# EAGLE design mainBoard (EAGLE 9.0.1)

## Sheet 1 of 3
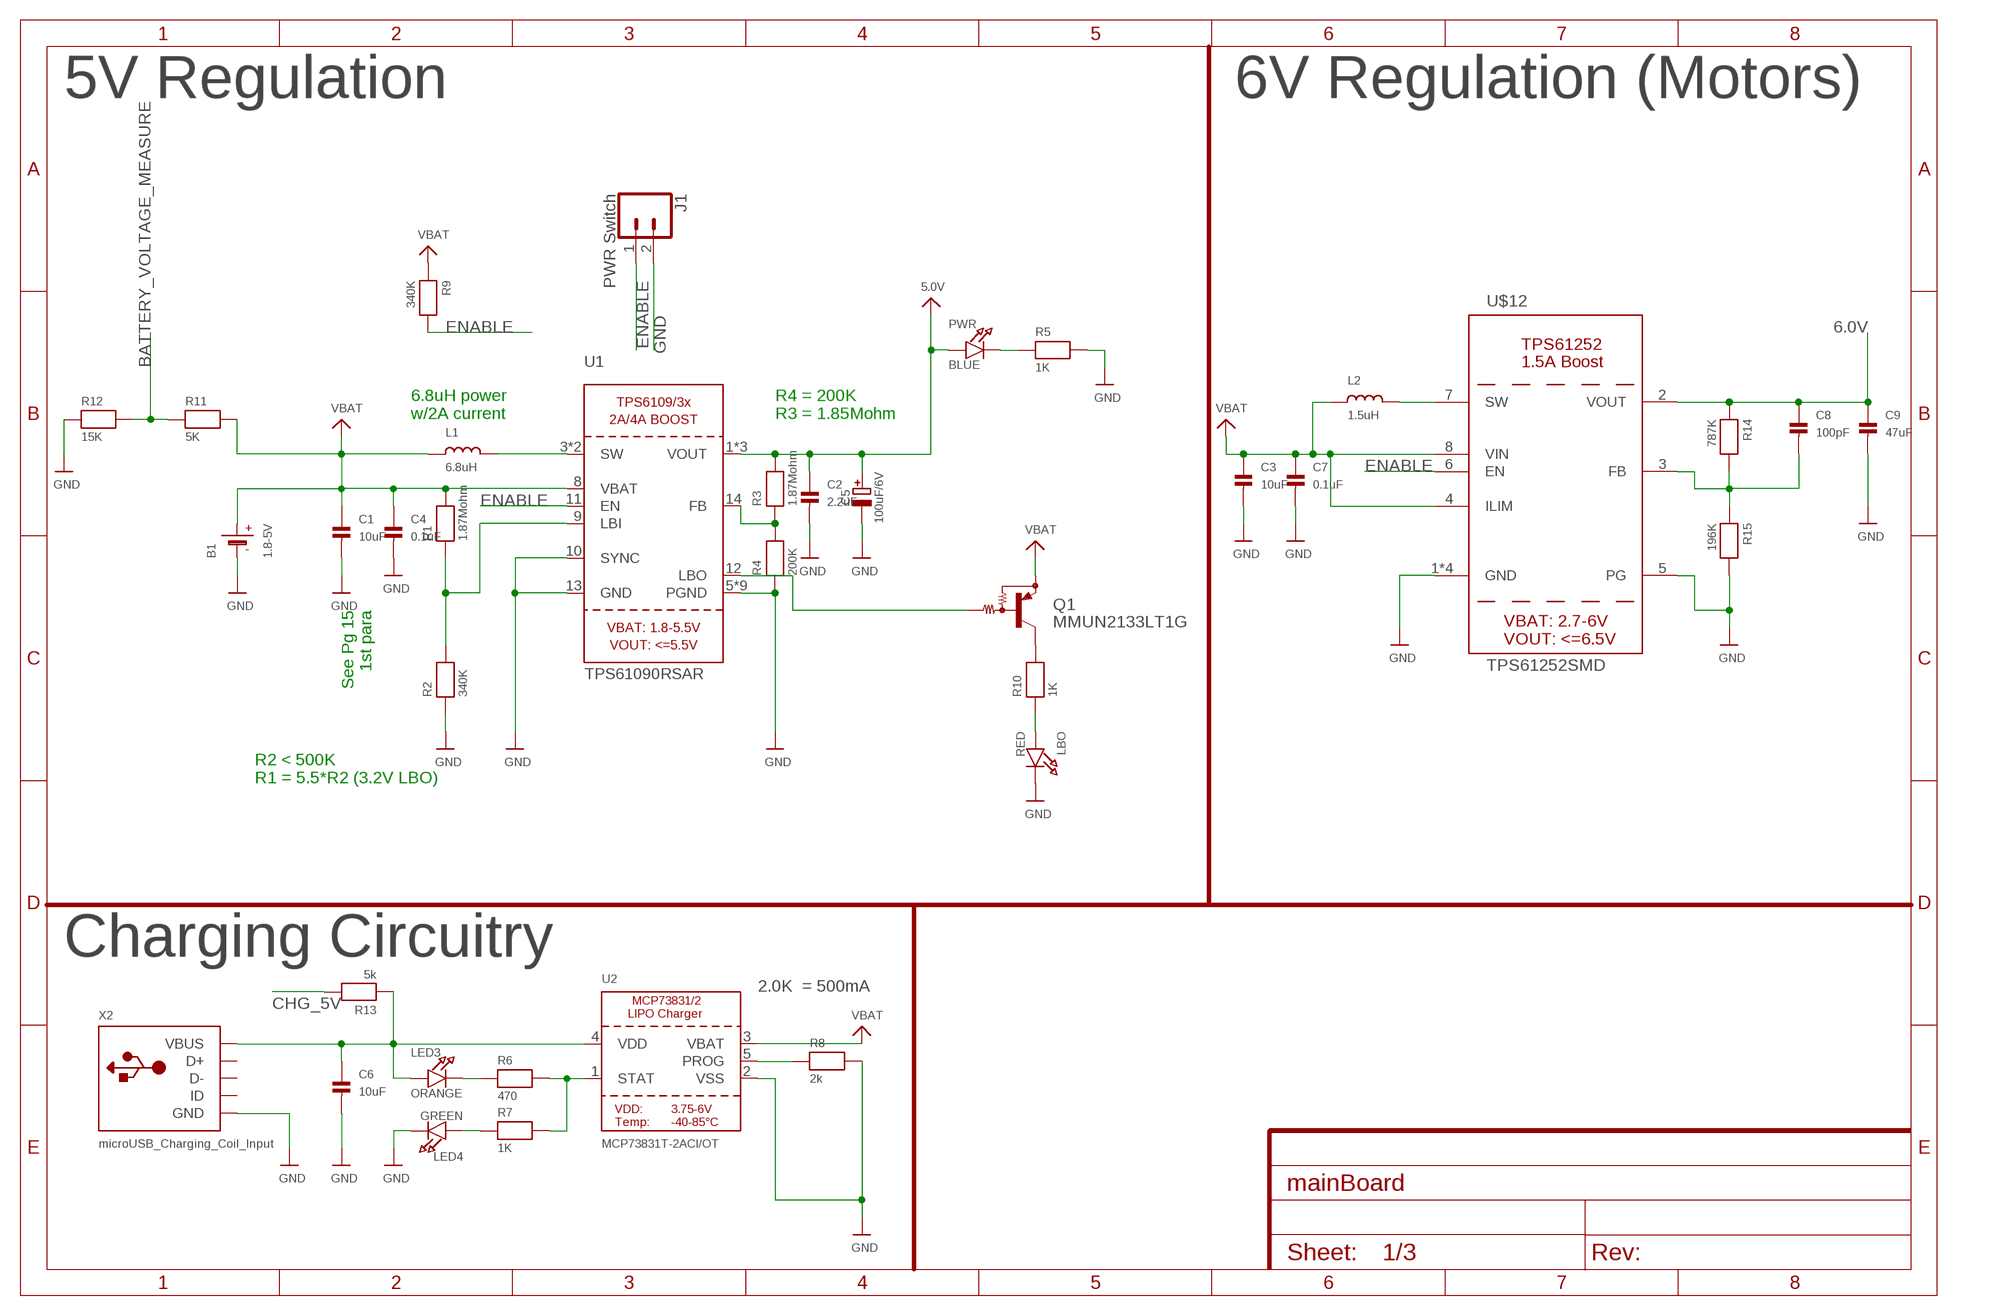
[diagram p0: schematic, sheet 1]
FRAME1 (FRAME-A4L): CNAME: Charging and Power Distribution; CREVISION: 1; DESIGNER: Sean Wilson

### Parts
B1  1.8-5V  BATTERY  [JSTPH2]
C1  10uF  CAP_CERAMIC0603  [0603]
C2  2.2uF  CAP_CERAMIC0603  [0603]
C3  10uF  CAP_CERAMIC0603  [0603]
C4  0.1uF  CAP_CERAMIC0805  [0805]
C5  100uF/6V  CAP_TANTALUMB/3528_REFLOW  [EIA3528-21/B-R]
C6  10uF  CAP_CERAMIC0603  [0603]
C7  0.1uF  CAP_CERAMIC0805  [0805]
C8  100pF  CAP_CERAMIC0603  [0603]
C9  47uF  CAP_CERAMIC1206  [1206]
J1  PWR Switch  CONN_02  [1X02]
L1  6.8uH  VISHAY_IHLP2525CZER6R8M01  [VISHAY_IHLP2525CZER6R8M01]
L2  1.5uH  MURATA_DFE252012P-1R5M=P2  [MURATA_DFE252012P-1R5M=P2]
LBO  RED  LED0805_NOOUTLINE  [CHIPLED_0805_NOOUTLINE]
LED3  ORANGE  LED0805_NOOUTLINE  [CHIPLED_0805_NOOUTLINE]
LED4  GREEN  LED0805_NOOUTLINE  [CHIPLED_0805_NOOUTLINE]
PWR  BLUE  LED0805_NOOUTLINE  [CHIPLED_0805_NOOUTLINE]
Q1  MMUN2133LT1G  MUN2114T1-PNP_DRIVER-SC59-BEC  [SC59-BEC]
R1  1.87Mohm  RESISTOR0805  [0805]
R2  340K  RESISTOR0805  [0805]
R3  1.87Mohm  RESISTOR0805  [0805]
R4  200K  RESISTOR0805  [0805]
R5  1K  RESISTOR0805  [0805]
R6  470  RESISTOR0805  [0805]
R7  1K  RESISTOR0805  [0805]
R8  2k  RESISTOR0805  [0805]
R9  340K  RESISTOR0805  [0805]
R10  1K  RESISTOR0805  [0805]
R11  5K  RESISTOR0805  [0805]
R12  15K  RESISTOR0805  [0805]
R13  5k  RESISTOR0805  [0805]
R14  787K  RESISTOR0805  [0805]
R15  196K  RESISTOR0805  [0805]
U1  TPS61090RSAR  VREG_TPS6103X  [PVQFN-16]
U2  MCP73831T-2ACI/OT  MCP73831/2  [SOT23-5]
U$12  TPS61252SMD  [TPS61252]
X2  microUSB_Charging_Coil_Input  USBMICRO_20329  [4UCONN_20329]

### Nets
5.0V: C2.1 C5.+ PWR.A R3.2 U1.1(VOUT) U1.15(VOUT) U1.16(VOUT) ; also sheet 2,3
6.0V: C8.1 C9.1 R14.1 U$12.2(VOUT) ; also sheet 3
BATTERY_VOLTAGE_MEASURE: R11.1 R12.2 ; also sheet 2
CHARGING_BOOL_5V: C6.1 LED3.A R13.1 U2.4(VDD) X2.VBUS
CHG_5V: R13.2 ; also sheet 2
ENABLE: J1.1 R9.2 U1.11(EN) U$12.6(EN)
GND: B1.1(-) C1.2 C2.2 C3.2 C4.2 C5.- C6.2 C7.2 C9.2 J1.2 LBO.C LED4.C R2.1 R4.1 R5.2 R8.2 R12.1 R15.2 U1.5(PGND) U1.6(PGND) U1.7(PGND) U1.10(SYNC) U1.13(GND) U1.P$18(PGND) U1.P$19(PGND) U1.P$20(PGND) U1.P$21(PGND) U1.P$22(PGND) U1.THERMAL(PGND) U2.2(VSS) U$12.1(GND) U$12.5(PG) U$12.P$2_GND(GND) U$12.P$3_GND(GND) U$12.THERMAL_GND(GND) X2.BASE@1(GND) X2.BASE@2(GND) X2.GND X2.SPRT@1(GND) X2.SPRT@2(GND) X2.SPRT@3(GND) X2.SPRT@4(GND) ; also sheet 2,3
LBO: Q1.B U1.12(LBO)
N$1: L1.P$2 U1.3(SW) U1.4(SW)
N$2: LBO.A R10.1
N$3: R1.1 R2.2 U1.9(LBI)
N$4: PWR.C R5.1
N$5: R3.1 R4.2 U1.14(FB)
N$6: LED3.C R6.1
N$7: R6.2 R7.2 U2.1(STAT)
N$8: R8.1 U2.5(PROG)
N$9: LED4.A R7.1
N$10: Q1.C R10.2
N$11: L2.P$2 U$12.7(SW)
N$12: C8.2 R14.2 R15.1 U$12.3(FB)
VBAT: B1.2(+) C1.1 C3.1 C4.1 C7.1 L1.P$1 L2.P$1 Q1.E R1.2 R9.1 R11.2 U1.8(VBAT) U2.3(VBAT) U$12.4(ILIM) U$12.8(VIN)
Unconnected: X2.D+ X2.D- X2.ID

### Notes on the sheet
- 5V Regulation | 6V Regulation (Motors)
- 6.8uH power
  w/2A current
- R4 = 200K
  R3 = 1.85Mohm
- See Pg 15
  1st para
- R2 < 500K
  R1 = 5.5*R2 (3.2V LBO)
- Charging Circuitry
- 2.0K  = 500mA

## Sheet 2 of 3
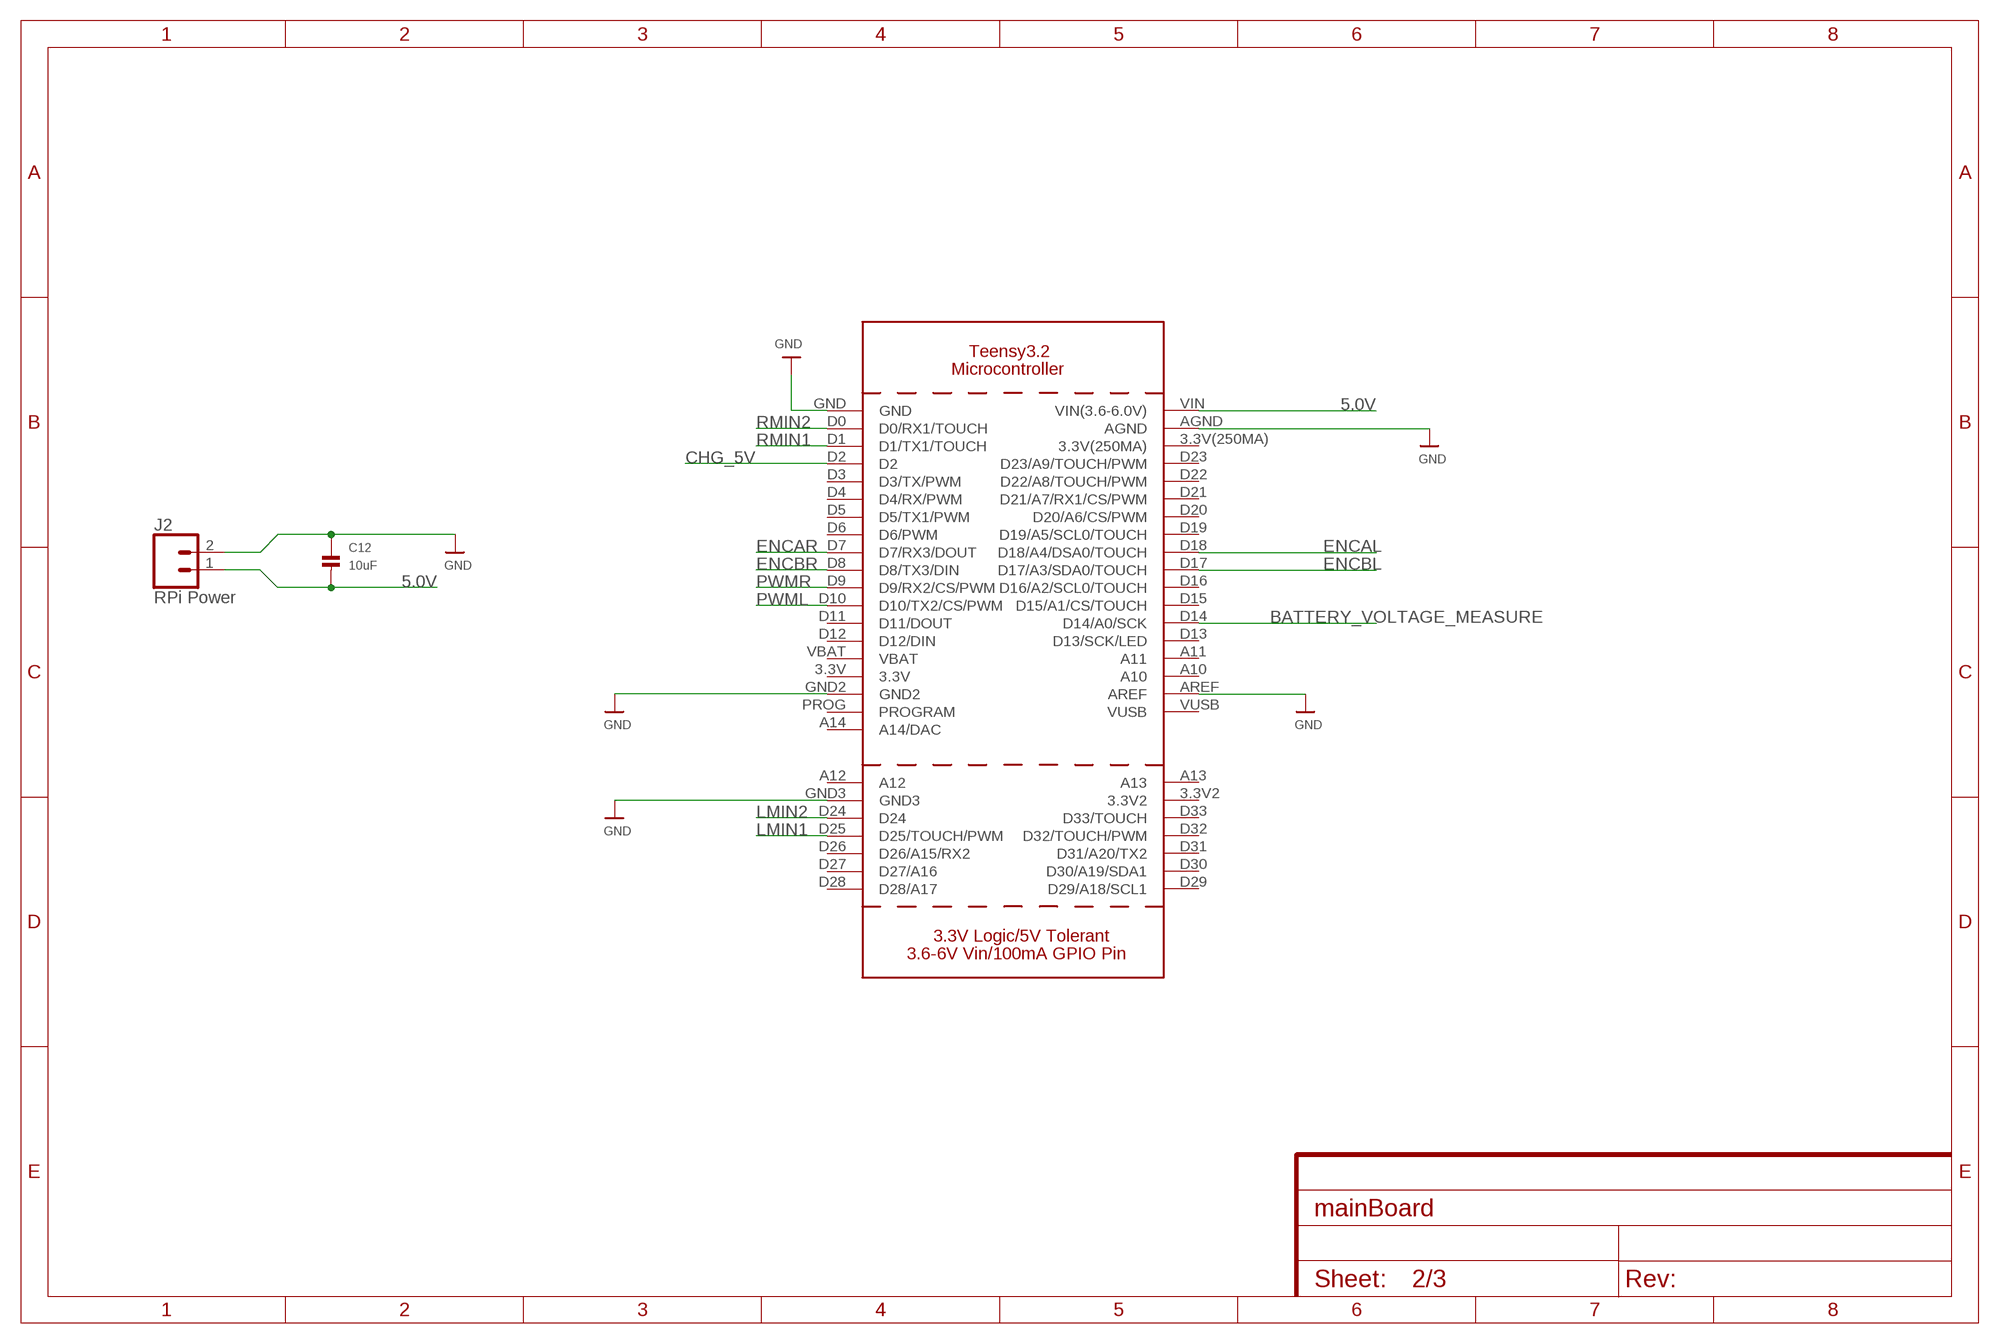
[diagram p1: schematic, sheet 2]
FRAME2 (FRAME-A4L): CNAME: Main Processor; CREVISION: 1; DESIGNER: Sean Wilson

### Parts
C12  10uF  CAP_CERAMIC0603  [0603]
J2  RPi Power  CONN_02  [1X02]
U$28  TEENSY3_2  [TEENSY3_2]

### Nets
5.0V: C12.2 J2.1 U$28.VIN(VIN(3.6-6.0V)) ; also sheet 1,3
BATTERY_VOLTAGE_MEASURE: U$28.D14(D14/A0/SCK) ; also sheet 1
CHG_5V: U$28.D2 ; also sheet 1
ENCAL: U$28.D18(D18/A4/DSA0/TOUCH) ; also sheet 3
ENCAR: U$28.D7(D7/RX3/DOUT) ; also sheet 3
ENCBL: U$28.D17(D17/A3/SDA0/TOUCH) ; also sheet 3
ENCBR: U$28.D8(D8/TX3/DIN) ; also sheet 3
GND: C12.1 J2.2 U$28.AGND U$28.AREF U$28.GND U$28.GND2 U$28.GND3 ; also sheet 1,3
LMIN1: U$28.D25(D25/TOUCH/PWM) ; also sheet 3
LMIN2: U$28.D24 ; also sheet 3
PWML: U$28.D10(D10/TX2/CS/PWM) ; also sheet 3
PWMR: U$28.D9(D9/RX2/CS/PWM) ; also sheet 3
RMIN1: U$28.D1(D1/TX1/TOUCH) ; also sheet 3
RMIN2: U$28.D0(D0/RX1/TOUCH) ; also sheet 3
Unconnected: U$28.3.3V U$28.3.3V2 U$28.3.3V(250MA) U$28.A10 U$28.A11 U$28.A12 U$28.A13 U$28.A14(A14/DAC) U$28.D3(D3/TX/PWM) U$28.D4(D4/RX/PWM) U$28.D5(D5/TX1/PWM) U$28.D6(D6/PWM) U$28.D11(D11/DOUT) U$28.D12(D12/DIN) U$28.D13(D13/SCK/LED) U$28.D15(D15/A1/CS/TOUCH) U$28.D16(D16/A2/SCL0/TOUCH) U$28.D19(D19/A5/SCL0/TOUCH) U$28.D20(D20/A6/CS/PWM) U$28.D21(D21/A7/RX1/CS/PWM) U$28.D22(D22/A8/TOUCH/PWM) U$28.D23(D23/A9/TOUCH/PWM) U$28.D26(D26/A15/RX2) U$28.D27(D27/A16) U$28.D28(D28/A17) U$28.D29(D29/A18/SCL1) U$28.D30(D30/A19/SDA1) U$28.D31(D31/A20/TX2) U$28.D32(D32/TOUCH/PWM) U$28.D33(D33/TOUCH) U$28.PROG(PROGRAM) U$28.VBAT U$28.VUSB

## Sheet 3 of 3
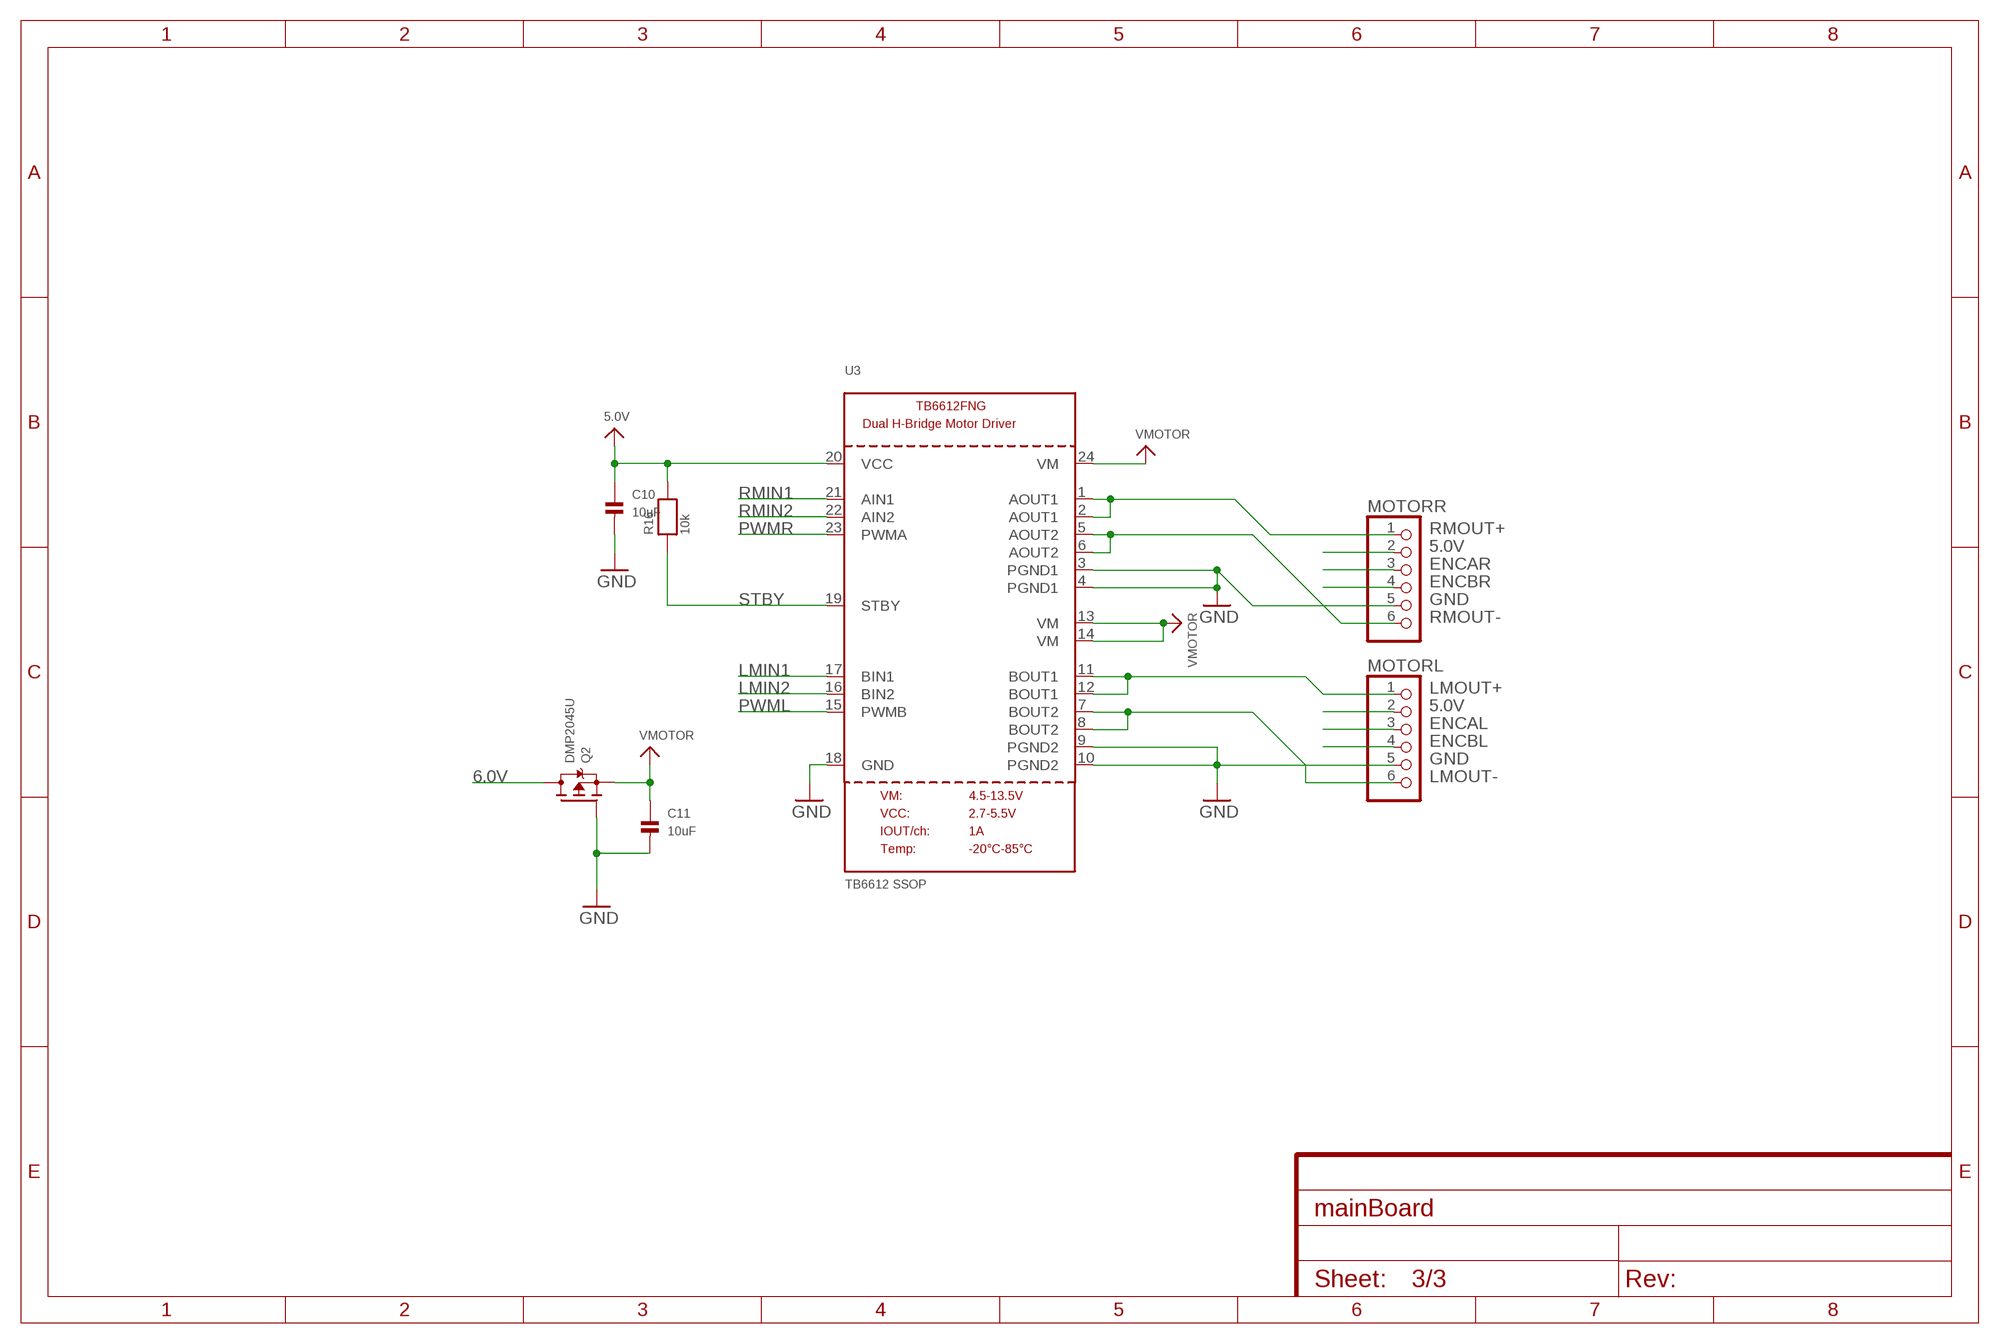
[diagram p2: schematic, sheet 3]
FRAME3 (FRAME-A4L): CNAME: Motor Driver; CREVISION: 1; DESIGNER: Sean Wilson

### Parts
C10  10uF  CAP_CERAMIC0603  [0603]
C11  10uF  CAP_CERAMIC0603  [0603]
MOTORL  PINHD-1X6CB  [1X06-CLEANBIG]
MOTORR  PINHD-1X6CB  [1X06-CLEANBIG]
Q2  DMP2045U  MOSFET-PWIDE  [SOT23-WIDE]
R16  10k  RESISTOR0805  [0805]
U3  TB6612 SSOP  TB6612FNGSSOP  [SSOP24]

### Nets
5.0V: C10.1 MOTORL.2 MOTORR.2 R16.2 U3.20(VCC) ; also sheet 1,2
6.0V: Q2.3(D) ; also sheet 1
ENCAL: MOTORL.3 ; also sheet 2
ENCAR: MOTORR.3 ; also sheet 2
ENCBL: MOTORL.4 ; also sheet 2
ENCBR: MOTORR.4 ; also sheet 2
GND: C10.2 C11.2 MOTORL.5 MOTORR.5 Q2.1(G) U3.3(PGND1) U3.4(PGND1) U3.9(PGND2) U3.10(PGND2) U3.18(GND) ; also sheet 1,2
LMIN1: U3.17(BIN1) ; also sheet 2
LMIN2: U3.16(BIN2) ; also sheet 2
LMOUT+: MOTORL.1 U3.11(BOUT1) U3.12(BOUT1)
LMOUT-: MOTORL.6 U3.7(BOUT2) U3.8(BOUT2)
PWML: U3.15(PWMB) ; also sheet 2
PWMR: U3.23(PWMA) ; also sheet 2
RMIN1: U3.21(AIN1) ; also sheet 2
RMIN2: U3.22(AIN2) ; also sheet 2
RMOUT+: MOTORR.1 U3.1(AOUT1) U3.2(AOUT1)
RMOUT-: MOTORR.6 U3.5(AOUT2) U3.6(AOUT2)
STBY: R16.1 U3.19(STBY)
VMOTOR: C11.1 Q2.2(S) U3.13(VM) U3.14(VM) U3.24(VM)

## Library data of the parts
B1 = microbuilder:BATTERY: CR1220 SMT - Digikey: 3001K-ND CD2032 BAT-HLD-001 - Digikey: BAT-HLD-001-ND
C1-C4 C6-C12 = microbuilder:CAP_CERAMIC: Ceramic Capacitors 0402 - 0402 Surface Mount Capacitors 16pF 50V 5% [Digikey: 445-4899-2-ND] 18pF 50V 5% [Digikey: 490-1281-2-ND] 22pF 50V 5% [Digikey: 490-1283-2-ND] 68pF 50V 5% [Digikey: 490-1289-2-ND] 0.1uF 10V 10% [Digikey: 490-1318-2-ND] 1.0uF 6.3V 10% [Digikey: 490-1320-2-ND] 0603 - 0603 Surface Mount Capacitors 16 pF 50V 5% [Digikey: 445-5051-2-ND] 22 pF 50V [Digikey: PCC220ACVTR-ND] 33 pF 50V 5% [Digikey: 490-1415-1-ND] 56pF 50V 5% [Digikey: 490-1421-1-ND] 220pF 50V 5% [Digikey: 445-1285-1-ND] 680 pF 50V 2200 pF 50V 5% C0G [Digikey: 445-1297-1-ND] 5600 pF 100V 5% X7R [Digikey: 478-3711-1-ND] 0.1 µF 25V 10% [Digikey: PCC2277TR-ND] 0.22 µF 16V 10% X7R [Digikey: 445-1318-1-ND] 1.0 µF 25V 10% [Digikey: 445-5146-2-ND] 0603 - RF Specific 3pF 250V +/-0.1pF RF [Digikey: 712-1347-1-ND] 18 pF 250V 5% [Digikey: 478-3505-1-ND or 712-1322-1-ND] 56 pF 250V 5% C0G RF [Digikey: 490-4867-1-ND] 68 pF 250V RF [Digikey: 490-4868-1-ND] 0805 - 0805 Surface Mount Capacitors 220 pF 250V 2% RF Ceramic Capacitor [Digikey: 712-1398-1-ND] 1000 pF 50V 2% NP0 Ceramic Capacitor [Digikey: 478-3760-1-ND] 0.1 µF 25V 10% Ceramic Capacitor [Digikey: PCC1828TR-ND] 1.0 µF 16V 10% Ceramic Capacitor[Digikey: 490-1691-2-ND] 10.0 µF 10V 10% Ceramic Capacitor[Digikey: 709-1228-1-ND] 10.0 uF 16V 10% Ceramic Capacitor [Digikey: 478-5165-2-ND] 47 uF 6.3V 20% Ceramic Capacitor [Digikey: 587-1779-1-ND or 399-5506-1-ND] 1206 - 1206 Surface Mount Capacitors 47uF 10V 20% Ceramic Capacitor [Digikey: 490-5528-1-ND or 399-5508-1-ND or 445-6010-1-ND] 100uF 6.3V -20%, +80% Y5V Ceramic Capacitor (Digikey: 490-4512-1-ND, Mouser: 81-GRM31CF50J107ZE1L)
C5 = microbuilder:CAP_TANTALUM: Tantalum Capacitors Wave footprints have larger pads and are meant to be used for hand soldering. Reflow footprints are optimised for solder paste and a reflow oven. EIA3216-18/A-[R/W] - Size A / 3216-18 / 1206 footprint 4.7µF 25V 10% Tantalum Capacitor 10µF 16V 10% Tantalum Capacitor [Digikey: 495-2236-2-ND] EIA3528-21/B-[R/W] - Size B / 3528-21 47µF 10V 10% Tantalum Capactior [Digikey: 495-2216-1-ND] EIA6032-28/C-[R/W] - Size C / 6032-28 10µF 35V 20% Tantalum Capacitor [Digikey: 495-2285-1-ND] 100µF 16V 10% Tantalum Capactior [Digikey: 399-5214-1-ND]
J1 J2 = SparkFun-Connectors:CONN_02: Multi connection point. Often used as Generic Header-pin footprint for 0.1 inch spaced/style header connections On any of the 0.1 inch spaced packages, you can populate with these: Break Away Headers - Straight <https://www.sparkfun.com/products/116> (PRT-00116) Break Away Male Headers - Right Angle <https://www.sparkfun.com/products/553> (PRT-00553) Female Headers <https://www.sparkfun.com/products/115> (PRT-00115) Break Away Headers - Machine Pin <https://www.sparkfun.com/products/117> (PRT-00117) Break Away Female Headers - Swiss Machine Pin <https://www.sparkfun.com/products/743> (PRT-00743) For SCREWTERMINALS and SPRING TERMINALS visit here: Screw Terimnals on SparkFun.com <https://www.sparkfun.com/search/results?term=Screw+Terminals> (5mm/3.5mm/2.54mm spacing) This device is also useful as a general connection point to wire up your design to another part of your project. Our various solder wires solder well into these plated through hole pads. Hook-Up Wire - Assortment (Stranded, 22 AWG) <https://www.sparkfun.com/products/11375> (PRT-11375) Hook-Up Wire - Assortment (Solid Core, 22 AWG) <https://www.sparkfun.com/products/11367> (PRT-11367) View the entire wire category on our website here <https://www.sparkfun.com/categories/141> Special notes: Molex polarized connector foot print use with: PRT-08233 with associated crimp pins and housings. 2.54_SCREWTERM for use with PRT-10571. 3.5mm Screw Terminal footprints for PRT-08084 5mm Screw Terminal footprints for use with PRT-08432
L1 = gritsbotx_electronics:VISHAY_IHLP2525CZER6R8M01
L2 = gritsbotx_electronics:MURATA_DFE252012P-1R5M=P2
LBO LED3 LED4 PWR = microbuilder:LED: LED 0603 - 0603 Surface Mount Package 2mA: Green LED - Low Power (3.9mcd, 2ma, 1.7Vf) - Digikey: 475-2709-2-ND Orange LED - Low Power (9.8mcd, 2ma, 1.8Vf) - Digikey: 475-1194-2-ND Red LED - Low Power (5mcd, 2ma, 1.8Vf) - Digikey: 475-1195-2-ND Yellow LED - Low Power (7mcd, 2ma, 1.8Vf) - Digikey: 475-1196-2-ND 5mA: Blue LED - Low Power (17mcd, 5ma, 2.9Vf) - Digikey: LNJ937W8CRACT-ND 0805 - 0805 Surface Mount Package 2mA: Red LED (8.8mcd, 2mA, 1.8Vf, Clear) - Low Power [Digikey: 475-2510-1-ND] Green LED (5mcd, 2mA, 1.8Vf, Clear) - Low Power [Digikey: 475-2730-1-ND] Yellow LED (11.3mcd, 2mA, 1.8Vf, Clear) - Low Power [Digikey: 475-2555-1-ND] 20mA: Red LED (104mcd, 20mA, Diffused) - LS R976 [Digikey: 475-1278-6-ND] Red LED (12mcd, 20mA, 2.0Vf, Clear) - APT2012EC [Digikey: 754-1128-1-ND] Green LED (15mcd, 20mA, 2.2Vf, Clear) - APT2012GC [Digikey: 754-1131-1-ND] Orange LED (160mcd, 20mA, 2.1Vf, Clear) - APT2012SECK [Digikey: 754-1130-1-ND] 1206 - 1206 Surface Mount Package Green LED (26mcd, 20mA, Diffused) - LG N971 [Digikey: 475-1407-6-ND] Red LED (15mcd, 20mA, Diffused) - LH N974 [Digikey: 475-1416-6-ND] Cree - Cree High-Power Surface Mount LEDs XPEBWT-L1-0000-00D50 - White 111lm 350mA 2.9Vf 6200K 110° XTEAWT-00-0000-00000LEE3 - White 114lm 350mA 2.85Vf 5000K 115° Everlight - Everlight 45-21 Series Surface Mount LEDs 45-21/QK2C-B2832AC2CB2/2T - Warm White 2000mcd 20mA 3.25Vf 3050K 120° 45-21/LK2C-B38452C4CB2/2T - Nuetral White 2000mcd 20mA 3.25Vf 4150K 120° 45-21/LK2C-B50634C6CB2/2T - Cold White 2200mcd 20mA 3.25Vf 5650K 120° PLCC2 Reverse Mount LS T77K-J1L2-1-0-2-R18-Z - Red 11.25mcd 2mA 1.8Vf 630nm 120° LO T77K-L1M2-24-Z - Orange 19.6mcd 2mA 1.8Vf 606nm 120° LY T77K-K2M1-26-Z - Yellow 15.7mcd 2mA 1.8Vf 587nm 120°
MOTORL MOTORR = adafruit:PINHD-1X6: PIN HEADER
Q1 = transistor:*-PNP_DRIVER-: PNP Bias Resistor Transistor
Q2 = microbuilder:MOSFET-P: P-Channel Mosfet LEGEND VDS: Voltage Drain-Source ID: Drain Current RDS(ON): Drain-Source On-State Resistance VGS(TH): Gate-Source Threshold Voltage CISS: Drain-Source Input Capacitance SOT-23 Name VDS ID RDS(ON) VGS(TH) CISS Order Number IRLML5103 30V 760mA 600 mOhm -- 75pF @ 25V Digikey: IRLML5103PBFCT-ND IRLML6401 12V 4.3A 50 mOhm 950mV @ 250µA 830pF @ 10V Digikey: IRLML6401PBFTR-ND NTR0202PL 20V 400mA 800 mOhm 2.3V @ 250uA 70pF @ 5V Digikey: NTR0202PLT1GOSTR-ND NTR4101PT1G 20V 1.8A 85 mOhm 1.2V @ 250uA 675pF @ 10V Digikey: NTR4101PT1GOSCT-ND DMP2004K 20V 600mA 900 mOhm 1V @ 250uA 175pF @ 16V Digikey: DMP2004KDICT-ND PMV65XP 20V 3.9A 76 mOhm 950mV @ 1mA 725pF @ 20V Digikey: 568-2358-2-ND TO-252 Name VDS ID RDS(ON) VGS(TH) CISS Order Number AOD417 30V 25A 34 mOhm 3V @ 250µA 920pF @ 15V Digikey: 785-1106-2-ND
R1-R16 = microbuilder:RESISTOR: Resistors 0402 - 0402 Surface Mount Package 22 Ohm 1% 1/16W [Digikey: 311-22.0LRTR-ND] 33 Ohm 5% 1/16W 1.0K 5% 1/16W 1.5K 5% 1/16W 2.0K 1% 1/16W 10.0K 1% 1/16W [Digikey: 311-10.0KLRTR-ND] 10.0K 5% 1/16W [Digikey: RMCF0402JT10K0TR-ND] 12.1K 1% 1/16W [Digikey: 311-22.0LRTR-ND] 100.0K 5% 1/16W 0603 - 0603 Surface Mount Package 0 Ohm 1/10 Watt 1% Resistor 15 Ohm 1/10 Watt 1% Resistor 33 Ohm 1/10 Watt 1% Resistor 49.9 Ohm 1/10 Watt 1% Resistor 100 Ohm 1/10 Watt 1% Resistor 150 Ohm 1/10 Watt 1% Resistor 240 Ohm 1/10 Watt 1% Resistor 390 Ohm 1/10 Watt 1% Resistor 560 Ohm 1/10 Watt 1% Resistor 680 Ohm 1/10 Watt 1% Resistor 750 Ohm 1/10 Watt 1% Resistor 1.0K Ohm 1/10 Watt 1% Resistor 1.5K Ohm 1/10 Watt 1% Resistor 2.0K Ohm 1/10 Watt 1% Resistor 2.2K Ohm 1/10 Watt 1% Resistor 3.3K Ohm 1/10 Watt 1% Resistor 4.7K Ohm 1/10 Watt 1% Resistor 10.0K Ohm 1/10 Watt 1% Resistor 12.0K Ohm 1/10 Watt 1% Resistor 12.1K Ohm 1/10 Watt 1% Resistor 20.0K Ohm 1/10 Watt 1% Resistor 33.0K Ohm 1/10 Watt 1% Resistor 100.0K Ohm 1/10 Watt 1% Resistor 0805 - 0805 Surface Mount Package 0 Ohm 1/8 Watt 1% Resistor 33 Ohm 1/8 Watt 1% Resistor 100 Ohm 1/8 Watt 1% Resistor 150 Ohm 1/8 Watt 1% Resistor 200 Ohm 1/8 Watt 1% Resistor 240 Ohm 1/8 Watt 1% Resistor 330 Ohm 1/8 Watt 1% Resistor 390 Ohm 1/8 Watt 1% Resistor 470 Ohm 1/8 Watt 1% Resistor 1.0K Ohm 1/8 Watt 1% Resistor 1.5K Ohm 1/8 Watt 1% Resistor 2.0K Ohm 1/8 Watt 1% Resistor 4.7K Ohm 1/8 Watt 1% Resistor 5.1K Ohm 1/8 Watt 1% Resistor 5.6K Ohm 1/8 Watt 1% Resistor 10.0K Ohm 1/8 Watt 1% Resistor 22.0K Ohm 1/8 Watt 1% Resistor 33.0K Ohm 1/8 Watt 1% Resistor 100K Ohm 1/8 Watt 1% Resistor 1206 - 1206 Surface Mount Package 2012 - 2010 Surface Mount Package 0.11 Ohm 1/2 Watt 1% Resistor - Digikey: RHM.11UCT-ND
U1 = microbuilder:VREG_TPS6103X: TPS6103x 4A Boost - 1.8-5.5V Input, Adjustable Output to 5.5V
U2 = microbuilder:MCP73831/2: MCP73831/2 LIPO Charger VDD: 3.75 - 6V Temp -40 - 85°C Programmable Charge Rate: 15-500mA NOTE: STAT is a tri-state logic output on the MCP73831 and an open-drain output on the MCP73832. SOT23-5 with 4.2V output and tri-state logic on STAT = MCP73831T-2ACI/OT
U3 = microbuilder:TB6612FNG: TB6612FNG Dual H-Bridge Motor Driver
U$12 = gritsbotx_electronics:TPS61252: Texas Instrument 1.5-A Boost Converter With Adjustable Input Current Limit. (2.7 - 6V input range to 0 - 6.5V output)
U$28 = gritsbotx_electronics:TEENSY3_2
X2 = microbuilder:USB: USB Connectors USBMINIB - Surface Mount Female Mini-B USB Connector 4UConnector: 06564

## Board
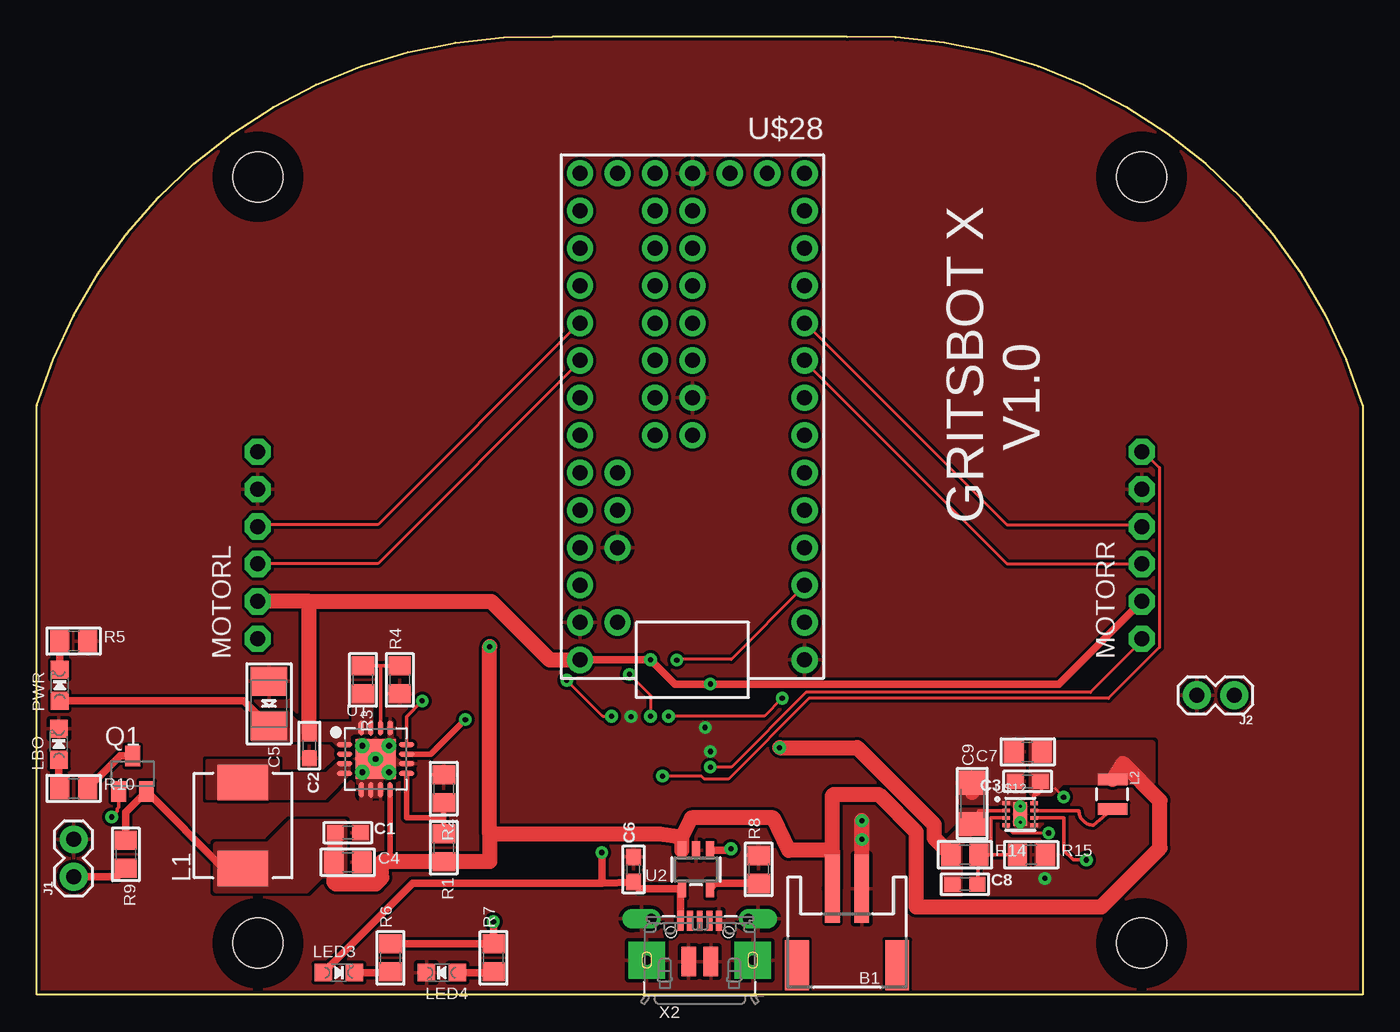
[diagram p3: board, top side]
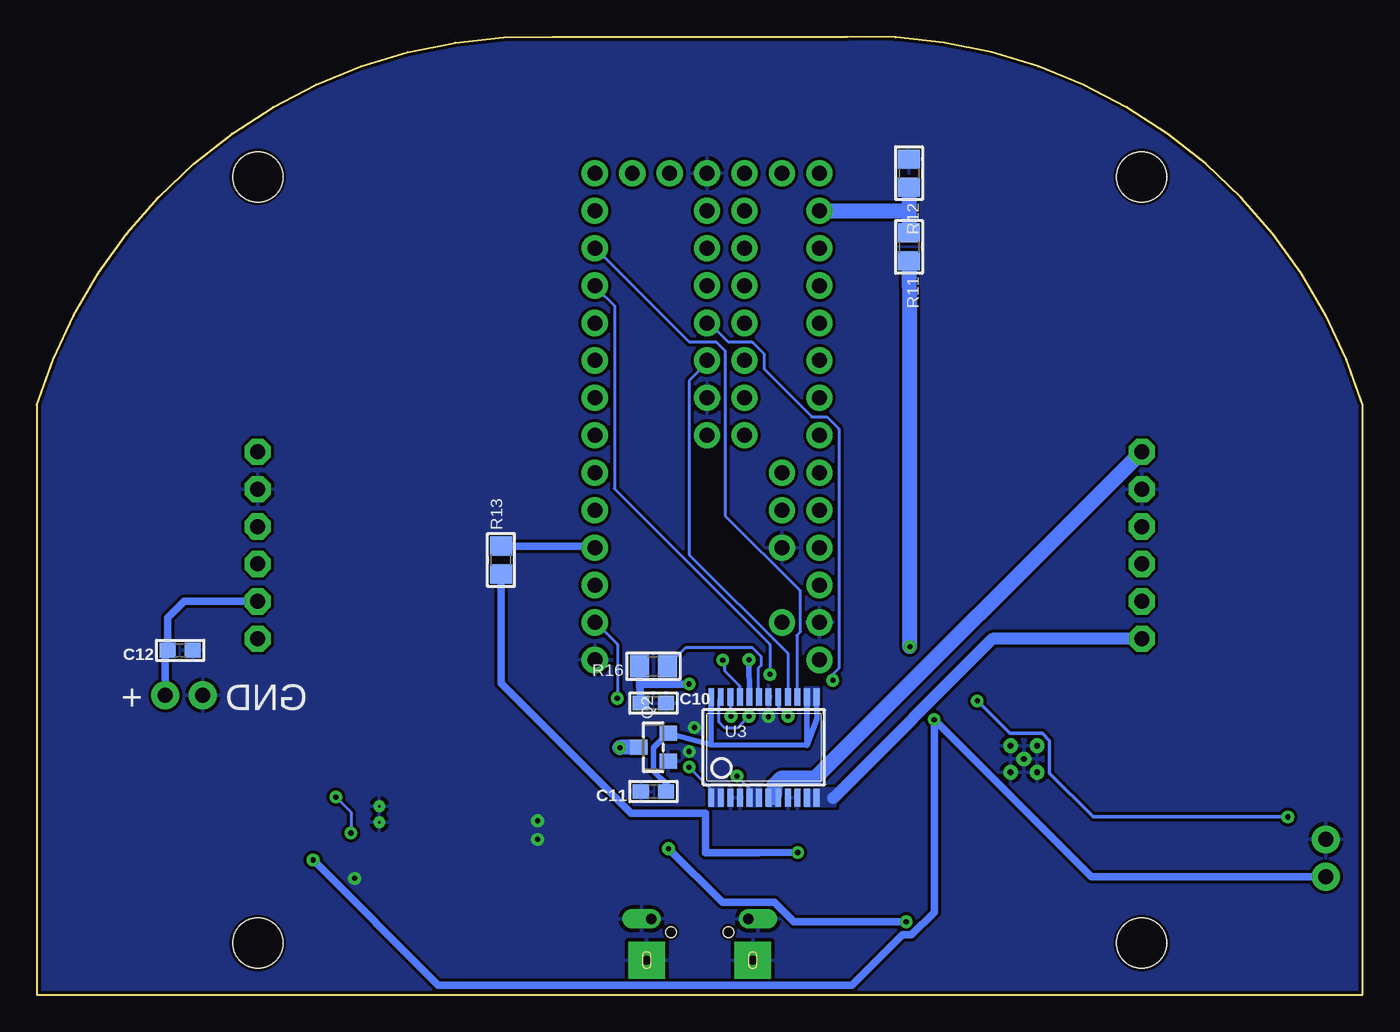
[diagram p4: board, bottom side, seen from below]

Size 90 x 65 mm. Coordinates in mm from the lower left corner, seen from the top.
Outline: 90,0 0,0 0,40 arc-75 35,65 55,65 arc-75 90,40 90,0
Copper layers (1*16): Top 0.035mm / dielectric 1.5mm / Bottom 0.035mm
Design rules "SparkFun": minimum track width 8mil, minimum drill 20mil, track to track 8mil, track to pad 8mil, pad to pad 8mil, via to via 8mil, smd to smd 8mil, copper to edge 8mil, drill to drill 8mil, minimum pad ring 12mil, minimum via ring 10mil, stop-mask expansion 4mil, vias tented up to drill 20mil, thermal gap 10mil

### Footprints (pad centres in the part's own frame; a part is rotated, then mirrored left to right if it is on the bottom)
JSTPH2 = smd 1 x 4.6: 1 -1,-3.7; 2 1,-3.7 | smd 1.6 x 3.4: NC1 -3.4,1.5; NC2 3.4,1.5
0603 = smd 1.1 x 1: 1 -0.85,0; 2 0.85,0
0805 = smd 1.3 x 1.5: 1 -0.95,0; 2 0.95,0
EIA3528-21/B-R = smd 1.95 x 2.5: + 1.525,0; - -1.525,0
1206 = smd 1.6 x 1.8: 1 -1.4,0; 2 1.4,0
1X02 = drill 1.016 pad 1.88: 1 0,0; 2 2.54,0
VISHAY_IHLP2525CZER6R8M01 = smd 2.413 x 3.429: P$1 -2.921,0; P$2 2.921,0
MURATA_DFE252012P-1R5M=P2 = smd 0.8 x 2: P$1 -1,0; P$2 1,0
CHIPLED_0805_NOOUTLINE = smd 1.2 x 1.2: A 0,-1.05; C 0,1.05
1X06-CLEANBIG = drill 1.016 pad 1.778 octagon: 1 -6.35,0; 2 -3.81,0; 3 -1.27,0; 4 1.27,0; 5 3.81,0; 6 6.35,0
SC59-BEC = smd 1 x 1.4: B -0.95,-1.2; C 0,1.2; E 0.95,-1.2
SOT23-WIDE = smd 1 x 1.2: 1 -0.95,-1; 2 0.95,-1; 3 0,1
PVQFN-16 = smd 1.05 x 0.35: 1 -2.1,0.975; 2 -2.1,0.325; 3 -2.1,-0.325; 4 -2.1,-0.975; 9 2.1,-0.975; 10 2.1,-0.325; 11 2.1,0.325; 12 2.1,0.975 | smd 0.35 x 1.05: 5 -0.975,-2.1; 6 -0.325,-2.1; 7 0.325,-2.1; 8 0.975,-2.1; 13 0.975,2.1; 14 0.325,2.1; 15 -0.325,2.1; 16 -0.975,2.1 | drill 0.4: P$18 0,0; P$19 -0.9,0.9; P$20 0.9,0.9; P$21 0.9,-0.9; P$22 -0.9,-0.9 | smd 2.7 x 2.7: THERMAL 0,0
SOT23-5 = smd 0.55 x 1.2: 1 -0.95,-1.3; 2 0,-1.3; 3 0.95,-1.3; 4 0.95,1.3; 5 -0.95,1.3
SSOP24 = smd 0.4 x 1.2: 1 -3.575,-3.42; 2 -2.925,-3.42; 3 -2.275,-3.42; 4 -1.625,-3.42; 5 -0.975,-3.42; 6 -0.325,-3.42; 7 0.325,-3.42; 8 0.975,-3.42; 9 1.625,-3.42; 10 2.275,-3.42; 11 2.925,-3.42; 12 3.575,-3.42; 13 3.575,3.42; 14 2.925,3.42; 15 2.275,3.42; 16 1.625,3.42; 17 0.975,3.42; 18 0.325,3.42; 19 -0.325,3.42; 20 -0.975,3.42; 21 -1.625,3.42; 22 -2.275,3.42; 23 -2.925,3.42; 24 -3.575,3.42
M3_SCREW = hole 3.4: 0,0
TPS61252 = smd 0.5 x 0.25: 1 -0.95,0.75; 2 -0.95,0.25; 3 -0.95,-0.25; 4 -0.95,-0.75; 5 0.95,-0.75; 6 0.95,-0.25; 7 0.95,0.25; 8 0.95,0.75 | drill 0.2 pad 0.406: P$2_GND 0,0.55; P$3_GND 0,-0.55 | smd 0.9 x 1.6: THERMAL_GND 0,0
TEENSY3_2 = drill 1.016 pad 1.778: 3.3V -2.54,-15.24; 3.3V2 2.54,0; 3.3V(250MA) 7.62,12.7; A10 5.08,7.62; A11 5.08,5.08; A12 0,2.54; A13 2.54,2.54; A14 5.08,-15.24; AGND 7.62,15.24; AREF 5.08,10.16; D0 -7.62,15.24; D1 -7.62,12.7; D2 -7.62,10.16; D3 -7.62,7.62; D4 -7.62,5.08; D5 -7.62,2.54; D6 -7.62,0; D7 -7.62,-2.54; D8 -7.62,-5.08; D9 -7.62,-7.62; D10 -7.62,-10.16; D11 -7.62,-12.7; D12 -7.62,-15.24; D13 7.62,-15.24; D14 7.62,-12.7; D15 7.62,-10.16; D16 7.62,-7.62; D17 7.62,-5.08; D18 7.62,-2.54; D19 7.62,0; D20 7.62,2.54; D21 7.62,5.08; D22 7.62,7.62; D23 7.62,10.16; D24 0,-2.54; D25 0,-5.08; D26 0,-7.62; D27 0,-10.16; D28 0,-12.7; D29 2.54,-12.7; D30 2.54,-10.16; D31 2.54,-7.62; D32 2.54,-5.08; D33 2.54,-2.54; GND -7.62,17.78; GND2 0,-15.24; GND3 0,0; PROG 2.54,-15.24; VBAT -5.08,-15.24; VIN 7.62,17.78; VUSB 5.08,15.24
4UCONN_20329 = smd 1 x 2: BASE@1 -0.75,-2; BASE@2 0.75,-2 | smd 0.4 x 1.35: D+ 0,0.775; D- -0.65,0.775; GND 1.3,0.775; ID 0.65,0.775; VBUS -1.3,0.775 | drill 0.7 offset: SPRT@1 -3.3,0.9; SPRT@2 3.3,0.9 | drill 0.6 pad 2.5 square: SPRT@3 -3.6,-1.9; SPRT@4 3.6,-1.9 | hole 0.7: -1.95,0; 1.95,0

### Placement (x,y rotation side)
B1  55,3.5 180 top
C1  21.11,10.99 0 top
C2  18.5,16.91 270 top
C3  67.26,14.48 180 top
C4  21.11,8.99 0 top
C5  15.75,19.75 270 top
C6  40.5,8.5 90 top
C7  67.26,16.48 180 top
C8  63,7.5 0 top
C9  63.5,12.98 90 top
C10  48.15,19.79 0 bottom
C11  48.15,13.79 180 bottom
C12  80.26,23.37 180 bottom
J1  2.5,8 90 top
J2  81.28,20.32 180 top
L1  14,11.48 90 top
L2  73.03,13.6 270 top
LBO  1.5,17 0 top
LED3  20.5,1.5 270 top
LED4  27.5,1.5 90 top
MOTORL  15,30.5 90 top
MOTORR  75,30.5 90 top
PWR  1.55,21 0 top
Q1  6.5,15 0 top
Q2  48.15,16.79 90 bottom
R1  27.63,9.98 270 top
R2  27.63,13.98 270 top
R3  22.14,21.36 270 top
R4  24.64,21.36 90 top
R5  2.5,24 0 top
R6  24,2.5 90 top
R7  31,2.5 90 top
R8  49,8.5 90 top
R9  6.04,9.53 270 top
R10  2.5,14 0 top
R11  30.79,50.75 270 bottom
R12  30.79,55.75 270 bottom
R13  58.5,29.5 90 bottom
R14  63,9.5 0 top
R15  67.5,9.5 0 top
R16  48.15,22.29 180 bottom
U1  23,16 0 top
U2  44.75,8.5 180 top
U3  40.65,16.79 0 bottom
U$1  [M3_SCREW]  15,55.5 0 top
U$2  [M3_SCREW]  75,55.5 0 top
U$3  [M3_SCREW]  15,3.5 0 top
U$4  [M3_SCREW]  75,3.5 0 top
U$12  66.75,12.25 0 top
U$28  44.5,40.5 180 top
X2  45,4.25 0 top

### Tracks (layer width: path | path; a pad name or v marks a point on that pad's centre or on a via)
5.0V  (via drill 0.35)
  Top 0.508: C5.+ 14.03,19.95 PWR.A | U$28.VIN v41.66,22.73 43.31,21.08 v45.72,21.08 69.39,21.08 MOTORR.2
  Top 1.016: C2.1 18.5,26.63 18.54,26.67 18.52,26.69 | 18.52,26.69 MOTORL.2 | 18.52,26.69 30.84,26.69 34.81,22.72 U$28.VIN
  Bottom 0.381: v41.66,22.73 U3.20
  Bottom 0.508: R16.2 49.1,21.08 | 49.1,21.08 C10.1 | v45.72,21.08 49.1,21.08 | MOTORR.2 79.99,26.69 81.11,25.57 C12.2 81.28,23.2 J2.1
  pour Top (no thermals): 22.73,17.78 22.73,20.95 21.46,20.95 21.46,18.41 17.78,18.41 17.78,17.27 19.18,17.27 20.07,17.27 20.45,16.89 21.21,16.89 21.21,17.53 21.46,17.78
  pour Top (no thermals): 14.61,19.05 14.61,17.27 17.78,17.27 17.78,18.41 17.02,19.18 14.61,19.18
6.0V  (via drill 0.35)
  Top 0.254: U$12.2 arc90 U$12.2 63.97,12.5 C9.1
  Top 1.016: R14.1 60.91,10.64 60.91,11.55 55.7,16.76 v50.42,16.76
  Bottom 1.016: Q2.3 50.39,16.79 v50.42,16.76
  pour Top (no thermals): 64.26,12.57 62.74,12.57 62.74,11.43 61.72,10.41 61.47,10.41 61.47,6.73 62.74,6.73 62.74,10.16 63.75,11.18 64.26,11.18
BATTERY_VOLTAGE_MEASURE
  Bottom 1.016: R12.2 30.79,53.34 | 30.79,53.34 R11.1 | U$28.D14 30.93,53.2 30.79,53.34
CHARGING_BOOL_5V  (via drill 0.35)
  Top 0.508: X2.VBUS 43.7,7.1 U2.4 40.85,7.2 C6.1 38.35,7.55 | 38.35,7.55 25.5,7.55 LED3.A | v38.35,9.65 38.35,7.55
  Bottom 0.508: v38.35,9.65 41.02,9.65 44.61,9.65 44.62,12.32 49.67,12.32 58.5,21.14 R13.1
CHG_5V
  Bottom 0.508: R13.2 52.23,30.45 U$28.D2
ENABLE  (via drill 0.35)
  Top 0.254: U$12.6 69.72,12 69.72,9.78 70.36,9.14 v71.25,9.14
  Top 0.381: U1.11 26.74,16.32 v29.08,18.67
  Top 0.508: R9.2 5.46,8 J1.1
  Bottom 0.508: J1.1 18.41,8 v29.08,18.67 29.08,5.61 30.62,4.07 31.24,4.07 34.66,0.64 62.75,0.64 v71.25,9.14
ENCAL
  Top 0.203: MOTORL.3 15.04,29.26 23.16,29.26 36.78,42.88 U$28.D18
ENCAR
  Top 0.203: MOTORR.3 74.98,29.26 65.84,29.26 52.22,42.88 U$28.D7
ENCBL
  Top 0.203: MOTORL.4 15.04,31.9 23.16,31.9 36.78,45.52 U$28.D17
ENCBR
  Top 0.203: MOTORR.4 74.98,31.9 65.84,31.9 52.22,45.52 U$28.D8
GND  (via drill 0.35)
  Top 0.203: 68.48,9.55 R15.2
  Top 0.889: 66.26,14.43 C3.2
  Top 1.016: 63.5,13.72 C9.2 | B1.1 v56.01,10.54 v56.01,11.81
  other vias: 40.34,18.87 45.36,18.14 45.72,16.51 68.43,7.9
  pour Top (no thermals): 66.93,17.27 65.66,17.27 65.66,14.61 62.74,14.61 62.74,13.34 65.28,13.34 65.53,12.95 66.42,12.95 66.42,11.43 67.82,11.43 67.82,8.76 69.09,8.76 69.09,10.29 68.33,10.29 68.33,11.56 67.18,11.56 67.18,12.83 66.93,12.95
  pour Top (no thermals): 23.37,14.3 21.97,14.3 21.97,11.81 21.49,11.81 21.49,10.29 22.68,10.29 22.68,13.44 23.37,13.44
  pour Top (no thermals): 23.39,14.35 21.77,14.35 21.77,14.68 21.77,17.3 23.93,17.3 23.93,18.49 24.05,18.49 24.1,18.49 24.1,17.32 24.28,17.32 24.28,14.71 23.39,14.71
  pour Top (no thermals): 25.55,15.77 24.28,15.77 24.28,15.62 25.55,15.62
  pour Bottom (rank 4): -0.89,-1.14 91.57,-1.14 91.57,0.64 91.57,66.29 91.19,66.29 -0.89,66.29
  pour Top (rank 4): -1.4,-1.4 91.06,-1.4 91.06,0.38 91.06,66.04 90.68,66.04 -1.4,66.04
LBO  (via drill 0.35)
  Top 0.254: v26.16,19.94 25.1,18.88 U1.12 | Q1.B 5.55,12.73 5.46,12.63 5.46,12.44 v5.08,12.06
  Bottom 0.254: v5.08,12.06 18.29,12.06 21.27,15.04 21.27,17.25 21.75,17.73 23.96,17.73 v26.16,19.94
LMIN1  (via drill 0.35)
  Top 0.203: v39.01,18.9 38.41,18.9 v35.97,21.34
  Bottom 0.203: v39.01,18.9 39.62,19.51 39.62,20.12 U3.17 | v35.97,21.34 35.97,21.74 35.56,22.15 35.56,38.41 36.37,39.22 37.39,39.22 40.64,42.47 40.64,43.48 41.45,44.3 43.08,44.3 44.3,45.52 U$28.D25
LMIN2
  Bottom 0.203: U3.16 39.01,20.32 39.01,23.16 45.72,29.87 45.72,41.66 44.5,42.88 U$28.D24
LMOUT+
  Bottom 0.813: MOTORL.1 25.13,24.15 35.94,13.34
  pour Bottom (no thermals): 37.85,13.97 37.85,12.83 35.81,12.83 35.81,13.97
LMOUT-
  Bottom 1.016: MOTORL.6 37.17,14.68 39.52,14.68 39.93,14.27 39.93,13.5 40.06,13.37
  pour Bottom (no thermals): 39.62,13.97 39.62,12.83 40.39,12.83 40.39,13.97
N$1
  pour Top (no thermals): 11.56,15.88 11.56,13.34 16.38,13.34 19.56,13.34 21.21,14.99 21.21,15.75 20.45,15.75 19.68,14.99 16.38,14.99 16.38,15.88
N$2
  Top 0.508: R10.1 1.5,14.05 LBO.A
N$3
  Top 0.381: R1.1 27.63,12.01 | 27.63,12.01 R2.2 | U1.9 25.1,12.01 27.63,12.01
N$4
  Top 0.508: PWR.C R5.1
N$5
  Top 0.254: R3.1 23.24,22.32 | 23.24,22.32 R4.2 | U1.14 23.32,22.23 23.24,22.32
N$6
  Top 0.508: LED3.C 23.95,1.5 R6.1
N$7  (via drill 0.35)
  Top 0.508: R6.2 R7.2 30.99,3.46 v30.99,4.95 | v47.12,9.91 47.01,9.8 U2.1
  Bottom 0.508: v30.99,4.95 38.62,4.95 39.93,6.26 43.47,6.26 v47.12,9.91
N$8
  Top 0.508: U2.5 46.05,7.55 R8.1
N$9
  Top 0.508: R7.1 30.95,1.5 LED4.A
N$10
  Top 0.508: R10.2 5.65,16.2 Q1.C
N$11
  Top 0.254: U$12.7 arc90 U$12.7 70.74,12.5 arc90 71.73,11.51 L2.P$2
N$12
  Top 0.254: 65.1,9.5 | 65.1,9.5 64.77,9.5 | 64.77,9.5 R14.2 C8.2 | 65.1,9.5 R15.1 | R15.1 | U$12.3 64.77,12 64.77,9.5
PWML
  Bottom 0.203: U3.15 38.41,20.32 38.41,24.38 38.2,24.59 38.2,27.43 43.28,32.51 43.28,43.69 43.89,44.3 45.72,44.3 52.02,50.6 U$28.D10
PWMR  (via drill 0.35)
  Top 0.203: v41.66,18.9 41.66,20.32 v40.23,21.74
  Bottom 0.203: v41.66,18.9 42.47,18.09 43.28,18.09 43.69,18.49 43.69,20.12 U3.23 | v40.23,21.74 40.23,23.77 50.8,34.34 50.8,46.74 52.02,47.95 U$28.D9
RMIN1  (via drill 0.35)
  Top 0.203: v43.43,22.71 43.48,22.76 47.14,22.76 52.02,27.64 U$28.D1
  Bottom 0.203: v43.43,22.71 43.28,22.55 43.28,21.95 42.27,20.93 42.27,20.32 U3.21
RMIN2  (via drill 0.35)
  Top 0.203: v50.6,20.12 49.38,18.9 v42.88,18.9
  Bottom 0.203: v42.88,18.9 42.88,20.12 U3.22 | v50.6,20.12 50.6,23.77 52.02,25.2 U$28.D0
RMOUT+  (via drill 0.35)
  Top 0.203: v45.72,15.44 47.14,15.44 52.22,20.52 71.53,20.52 74.98,23.98 MOTORR.1
  Bottom 0.203: v45.72,15.44 44.3,14.02 44.32,13.97
  pour Bottom (no thermals): 43.43,13.97 43.43,12.83 44.32,12.83 44.32,13.97
RMOUT-  (via drill 0.35)
  Top 0.203: v42.47,14.83 45.11,14.83 45.31,14.63 46.94,14.63 52.43,20.12 72.75,20.12 76.2,23.57 76.2,35.76 75.18,36.78 MOTORR.6
  Bottom 0.203: v42.47,14.83 41.66,14.02 41.66,13.97
  pour Bottom (no thermals): 40.89,13.97 40.89,12.83 41.66,12.83 41.66,13.97
STBY
  Bottom 0.203: U3.19 41.05,20.32 41.05,22.15 40.84,22.35 40.84,22.96 41.45,23.57 45.92,23.57 47.14,22.35 R16.1
VBAT  (via drill 0.35)
  Top 0.203: v68.68,10.97 66.24,10.97 65.84,11.38 U$12.4 | 69.11,13.99 v69.7,13.41 | U2.3 43.89,9.75 43.76,9.8
  Top 0.254: U$12.8 arc-90 U$12.8 67.69,13.56 arc90 68.21,14.09 C3.1
  Top 0.381: U1.8 23.98,9.03 24,9.03
  Top 0.508: R9.1 6.04,12.39 Q1.E 12.69,8.56 L1.P$1
  Top 1.016: 54,9.8 B1.2 | 43.76,10.7 44.43,12 50,12 51.05,9.8 54,9.8 | 43.76,10.7 43.76,9.8 | 43.76,10.7 42.28,10.91 30.73,10.91 | C1.1 C4.1 20.16,7.65 20.28,7.53 23,7.53 23.42,7.95 23.42,9.03 24,9.03 R1.2 30.73,9.03 30.73,10.91 | 54,9.8 54,13.49 54.1,13.59 57.15,13.59 59.69,11.05 59.69,5.97 72.27,5.97 76.24,9.94 76.24,13.16 73.71,15.7 L2.P$1 | 30.73,10.91 v30.73,23.62
  Bottom 0.203: v68.68,10.97 68.68,12.39 v69.7,13.41
  Bottom 1.016: v30.73,23.62 30.73,47.32 R11.2
  pour Top (no thermals): 67.56,17.02 75.69,17.02 75.69,14.48 69.6,14.48 68.83,13.72 67.56,13.72
  pour Top (no thermals): 20.83,11.68 19.3,11.68 17.27,11.68 15.75,10.16 12.19,10.16 12.19,7.11 15.75,7.11 18.29,7.11 19.3,8.13 20.83,8.13
VMOTOR
  Bottom 0.381: U3.24 44.22,16.97 | 44.22,16.97 Q2.2 48.14,16.75 48.14,15.18 47.2,14.23 C11.1 | 44.22,16.97 37.72,16.94 | 37.72,16.94 U3.14 | U3.13 37.06,18.72 37.72,16.94
  pour Bottom (no thermals): 37.85,19.68 37.85,20.83 36.96,20.83 36.96,19.68

### Text on the board
tPlace: GRITSBOT X / V1.0
bPlace: GND | +